# EAGLE design lcd_driver (EAGLE 5.10)
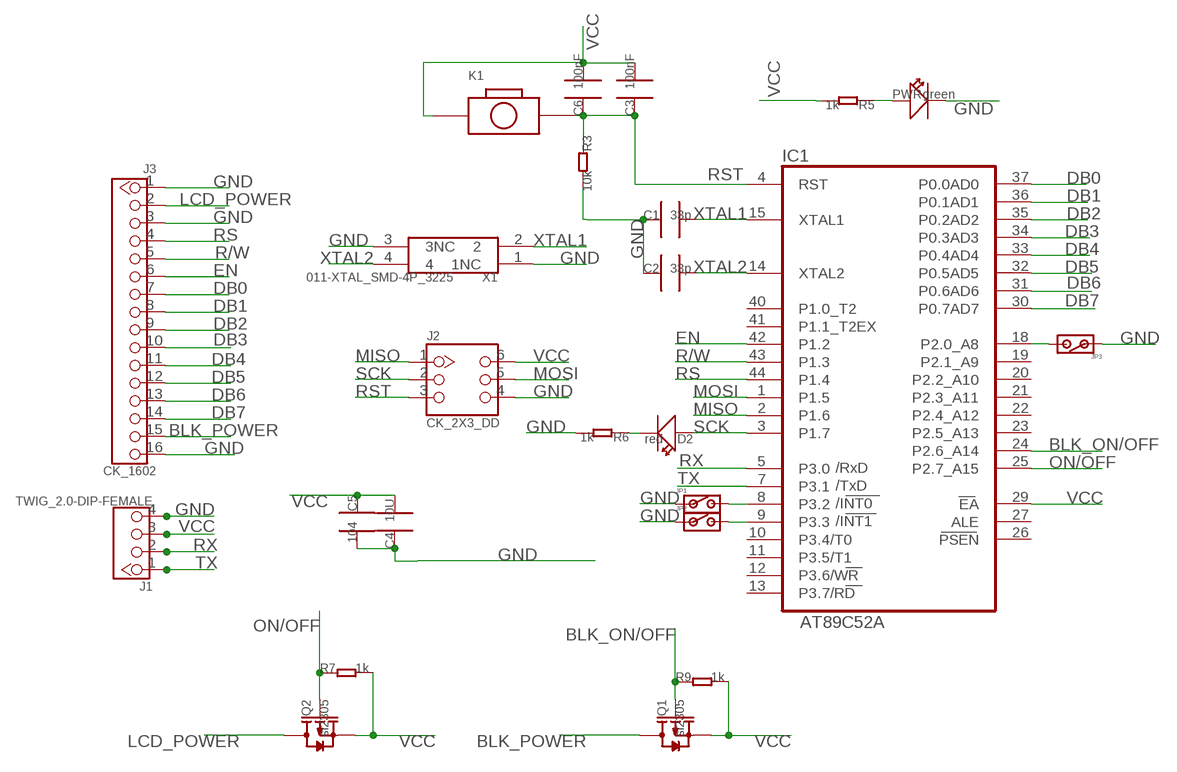
[diagram p0: schematic, sheet 1]

## Parts
C1  33p  006-C0603  [0603]
C2  33p  006-C0603  [0603]
C3  100nF  006-C0603  [0603]
C4  10U  006-C0805  [0805]
C5  104  006-C0603  [0603]
C6  100nF  006-C0603  [0603]
D2  red  LED0603_DD  [LED0603]
IC1  AT89C52A  [TQFP44]
J1  TWIG_2.0-DIP-FEMALE  [2.0_1X4]
J2  CK_2X3_DD  [CK_2X3]
J3  CK_1602  [CK_1602]
JP1  008-JP_SW  [JP_SW]
JP2  008-JP_SW  [JP_SW]
JP3  008-JP_SW  [JP_SW]
K1  BOTTON_1_DP  [BTN_5.0_RST]
PWR  green  LED0603_DD  [LED0603]
Q1  si2305  014-P-MOSFETSOT23  [SOT23_]
Q2  si2305  014-P-MOSFETSOT23  [SOT23_]
R3  10k  005-R0603  [0603]
R5  1k  005-R0603  [0603]
R6  1k  005-R0603  [0603]
R7  1k  005-R0603  [0603]
R9  1k  005-R0603  [0603]
X1  011-XTAL_SMD-4P_3225  [X3225]

## Nets
BLK_ON/OFF: IC1.24(P2.6_A14) Q1.1(G) R9.1
BLK_POWER: J3.15 Q1.3(D)
DB0: IC1.37(P0.0AD0) J3.7
DB1: IC1.36(P0.1AD1) J3.8
DB2: IC1.35(P0.2AD2) J3.9
DB3: IC1.34(P0.3AD3) J3.10
DB4: IC1.33(P0.4AD4) J3.11
DB5: IC1.32(P0.5AD5) J3.12
DB6: IC1.31(P0.6AD6) J3.13
DB7: IC1.30(P0.7AD7) J3.14
EN: IC1.42(P1.2) J3.6
GND: C1.1 C2.1 C4.1 C5.2 J1.4 J2.4 J3.1 J3.3 J3.16 JP1.1 JP2.1 JP3.1 PWR.2(-) R3.2 R6.2 X1.1(1NC) X1.3(3NC)
LCD_POWER: J3.2 Q2.3(D)
MISO: IC1.2(P1.6) J2.1
MOSI: IC1.1(P1.5) J2.5
N$1: IC1.8(P3.2) JP1.2
N$2: IC1.9(P3.3) JP2.2
N$4: PWR.1(+) R5.1
N$6: D2.2(-) R6.1
N$7: IC1.18(P2.0_A8) JP3.2
ON/OFF: IC1.25(P2.7_A15) Q2.1(G) R7.1
R/W: IC1.43(P1.3) J3.5
RS: IC1.44(P1.4) J3.4
RST: C3.1 C6.1 IC1.4(RST) J2.3 K1.P$2 R3.1
RX: IC1.5(P3.0) J1.2
SCK: D2.1(+) IC1.3(P1.7) J2.2
TX: IC1.7(P3.1) J1.1
VCC: C3.2 C4.2 C5.1 C6.2 IC1.29(EA) J1.3 J2.6 K1.P$1 Q1.2(S) Q2.2(S) R5.2 R7.2 R9.2
XTAL1: C1.2 IC1.15(XTAL1) X1.2
XTAL2: C2.2 IC1.14(XTAL2) X1.4
Unconnected: IC1.10(P3.4/T0) IC1.11(P3.5/T1) IC1.12(P3.6/WR) IC1.13(P3.7/RD) IC1.19(P2.1_A9) IC1.20(P2.2_A10) IC1.21(P2.3_A11) IC1.22(P2.4_A12) IC1.23(P2.5_A13) IC1.26(PSEN) IC1.27(ALE) IC1.40(P1.0_T2) IC1.41(P1.1_T2EX)

## Power pins joined to a net without a drawn wire
GND: IC1.16(GND)
VCC: IC1.38(VCC)

## Library data of the parts
C1-C6 = Discrete:006-C*: Ceramic Capacitors
D2 PWR = CPT_SMD:LED0603
IC1 = atmel:AT89C*52: MICROCONTROLLER 8 Kbytes FLASH; 2K Bytes EEPROM Compatible with MCS-51 Products at89s8252.pdf
J1 = Connector:TWIG_2.0-DIP-FEMALE
J2 = CONNECTER:CK_2X3
J3 = CONNECTER:CK_1602
JP1-JP3 = Discrete:008-JP_SW
K1 = CPT_SMD:BOTTON_1
Q1 Q2 = Discrete:014-P-MOSFET*: Si2305DS Si2323CDS
R3 R5-R7 R9 = Discrete:005-R*
X1 = Discrete:011-XTAL_SMD-4P

## Net classes
0 default: width 0.203 mm, drill 0.305 mm, clearance 0.203 mm

## Board
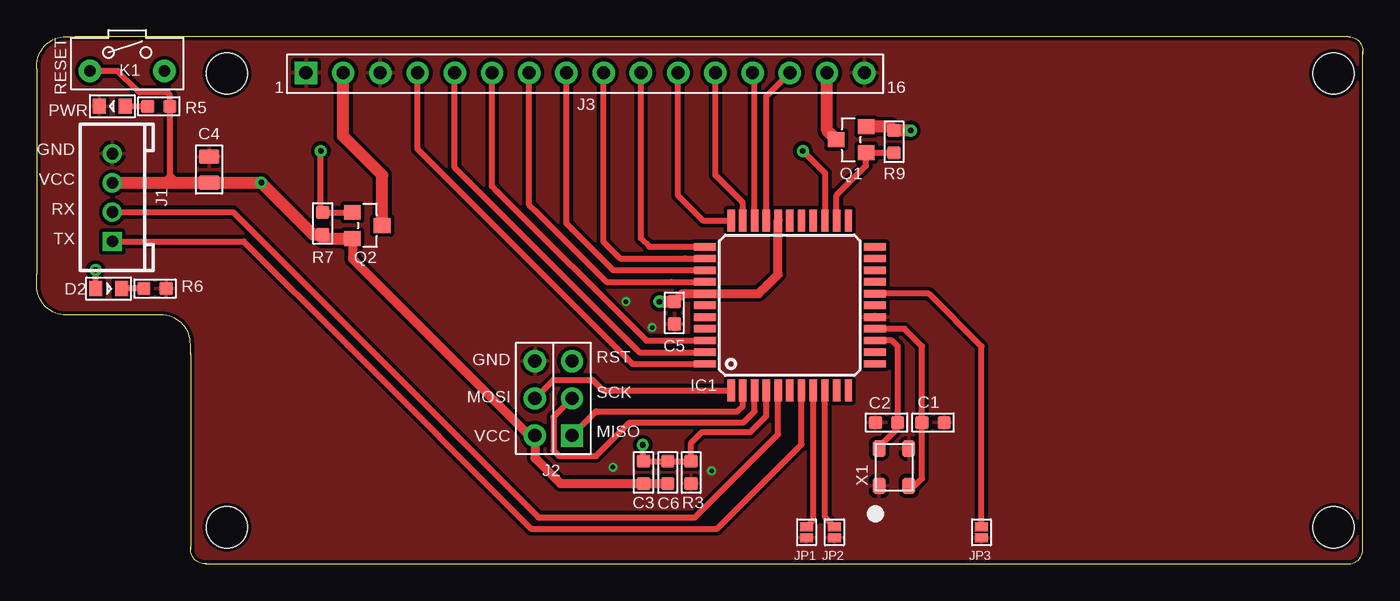
[diagram p1: board, top side]
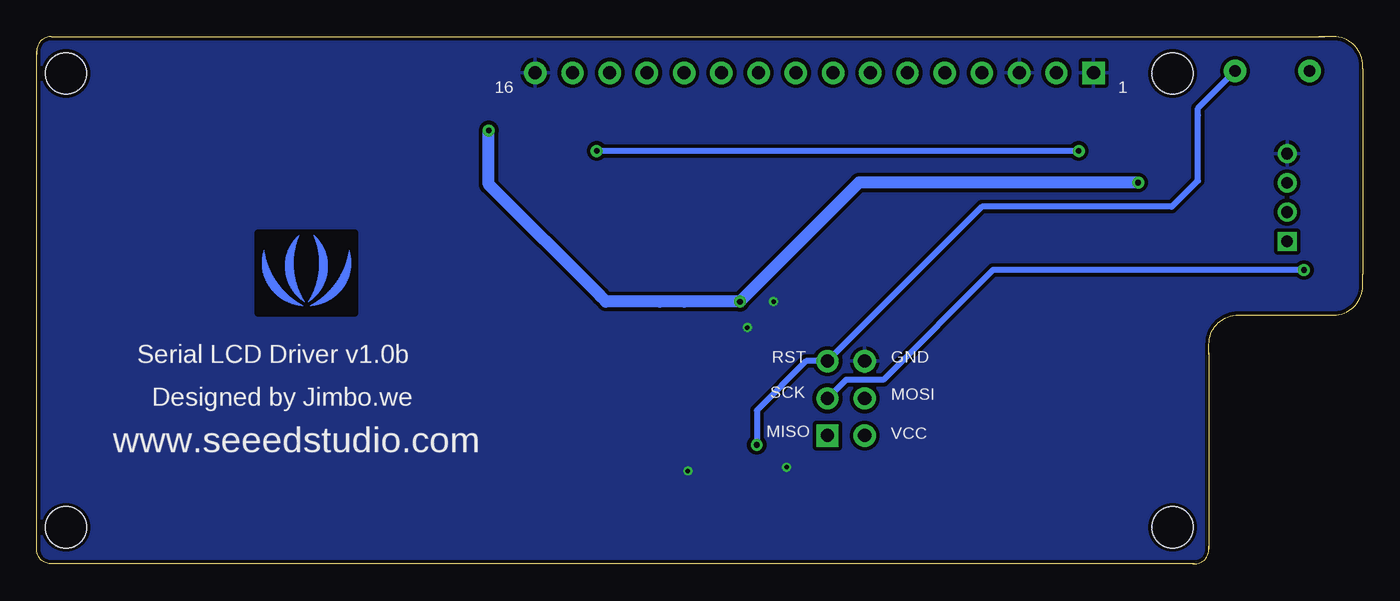
[diagram p2: board, bottom side, seen from below]

Size 90.5 x 36 mm. Coordinates in mm from the lower left corner, seen from the top.
Outline: 10.5,14.35 10.5,14.4
Outline: 10.5,14.4 10.5,14.35
Outline: 10.5,14.35 10.5,14.3
Outline: 10.5,14.3 10.5,1.2
Outline: 10.5,1.2 10.5,1
Outline: 11.5,0 11.6,0
Outline: 11.6,0 89.5,0 arc90 90.5,1
Outline: 90.5,1 90.5,1.1
Outline: 90.5,1.1 90.5,34.8
Outline: 90.5,34.8 90.5,35
Outline: 3,36 10.5,36 89.5,36 arc-90 90.5,35
Outline: 3,36 2.6,36
Outline: 0,19.8 0,33.8 0,33.9 0,34 arc-90 2,36 3,36
Outline: 0,19.8 0,19.76
Outline: 10.5,14.35 10.5,14.4
Outline: 90.5,35 90.5,34.8
Outline: 90.5,1 90.5,1.1
Outline: 11.6,0 11.5,0
Outline: 11.5,0 arc-90 10.5,1
Outline: 10.5,1 10.5,1.2
Outline: 10.5,14.3 10.5,15 arc90 8.5,17 2,17 arc-90 0,19 0,19.8
Copper layers (1*16): Top 0.035mm / dielectric 1.5mm / Bottom 0.035mm
Design rules "SeeedStudio_rule_no_angle_090911": minimum track width 6mil, minimum drill 12mil, track to track 6mil, track to pad 6mil, pad to pad 6mil, via to via 6mil, smd to smd 0mil, copper to edge 10mil, drill to drill 10mil, minimum pad ring 10mil, minimum via ring 6mil, stop-mask expansion 2mil, vias tented up to drill 100mil, thermal gap 10mil
Holes 2.8 mm at 88.5,33.5 88.5,2.5 13,2.5 13,33.5
bKeepout: area 68.8,17.1 to 75.4,22.6
bRestrict: area 68.8,17.1 to 75.4,22.6
vRestrict: area 17.5,28 to 23.3,32; area 17.5,4 to 23.3,8.2; area 46.9,28 to 52.7,32; area 46.9,4 to 52.7,8.2; area 76.7,28 to 82.5,32; area 76.7,4 to 82.5,8.2; area 27.8,8.6 to 42.2,23; area 57.5,10.3 to 68.5,21.3; area 76.5,11.2 to 82.5,16.2; area 13.5,11.7 to 18.2,26.5; area 18.4,8.8 to 23.2,11.4

### Footprints (pad centres in the part's own frame; a part is rotated, then mirrored left to right if it is on the bottom)
0603 = smd 0.889 x 0.889: 1 -0.762,0; 2 0.762,0
0805 = smd 1.016 x 1.397: 1 -0.889,0; 2 0.889,0
LED0603 = smd 0.889 x 1.016: 1 -0.889,0; 2 0.889,0
TQFP44@1 = smd 1.5 x 0.5: 1 -5.8,4; 2 -5.8,3.2; 3 -5.8,2.4; 4 -5.8,1.6; 5 -5.8,0.8; 6 -5.8,0; 7 -5.8,-0.8; 8 -5.8,-1.6; 9 -5.8,-2.4; 10 -5.8,-3.2; 11 -5.8,-4; 23 5.8,-4; 24 5.8,-3.2; 25 5.8,-2.4; 26 5.8,-1.6; 27 5.8,-0.8; 28 5.8,0; 29 5.8,0.8; 30 5.8,1.6; 31 5.8,2.4; 32 5.8,3.2; 33 5.8,4 | smd 0.5 x 1.5: 12 -4,-5.8; 13 -3.2,-5.8; 14 -2.4,-5.8; 15 -1.6,-5.8; 16 -0.8,-5.8; 17 0,-5.8; 18 0.8,-5.8; 19 1.6,-5.8; 20 2.4,-5.8; 21 3.2,-5.8; 22 4,-5.8; 34 4,5.8; 35 3.2,5.8; 36 2.4,5.8; 37 1.6,5.8; 38 0.8,5.8; 39 0,5.8; 40 -0.8,5.8; 41 -1.6,5.8; 42 -2.4,5.8; 43 -3.2,5.8; 44 -4,5.8
2.0_1X4 = drill 0.8 pad 1.27 square: 1 -3,0 | drill 0.8 pad 1.27 round: 2 -1,0; 3 1,0; 4 3,0
CK_2X3 = drill 0.889 pad 1.524 square: 1 -1.27,2.54 | drill 0.889 pad 1.524 round: 2 -1.27,0; 3 -1.27,-2.54; 4 1.27,-2.54; 5 1.27,0; 6 1.27,2.54
CK_1602 = drill 0.889 pad 1.524 square: 1 0,19.05 | drill 0.889 pad 1.524 round: 2 0,16.51; 3 0,13.97; 4 0,11.43; 5 0,8.89; 6 0,6.35; 7 0,3.81; 8 0,1.27; 9 0,-1.27; 10 0,-3.81; 11 0,-6.35; 12 0,-8.89; 13 0,-11.43; 14 0,-13.97; 15 0,-16.51; 16 0,-19.05
JP_SW = smd 0.889 x 0.61: 1 0,0.381; 2 0,-0.381
BTN_5.0_RST = drill 0.762 pad 1.524 round: P$1 0,2.54; P$2 0,-2.54
SOT23_ = smd 1.016 x 1.143: 1 -0.889,-1.016; 2 0.889,-1.016; 3 0,1.016
X3225 = smd 1.143 x 0.889: 1 -1.27,1.016; 2 -1.27,-1.016; 3 1.27,-1.016; 4 1.27,1.016

### Placement (x,y rotation side)
C1  61.17,9.65 180 top
C2  58,9.65 0 top
C3  41.41,6.25 270 top
C4  11.77,26.92 270 top
C5  43.52,17.14 270 top
C6  43.06,6.25 270 top
D2  4.91,18.8 0 top
IC1  AT89C52A  [TQFP44@1]  51.39,17.65 90 top
J1  5.17,25.02 90 top
J2  35.27,11.3 180 top
J3  37.42,33.53 90 top
JP1  52.54,2.16 180 top
JP2  54.44,2.16 180 top
JP3  64.47,2.16 180 top
K1  6.18,33.66 90 top
LOGO2  LOGO_COPPER200X166  [LOGO_COPPER]  72.09,19.3 0 bottom
PWR  5.17,31.24 180 top
Q1  55.59,28.96 90 top
Q2  22.56,23.11 270 top
R3  44.66,6.25 270 top
R5  8.34,31.24 0 top
R6  8.09,18.8 0 top
R7  19.52,23.24 270 top
R9  58.51,28.83 90 top
X1  58.51,6.6 90 top

### Tracks (layer width: path | path; a pad name or v marks a point on that pad's centre or on a via)
BLK_ON/OFF
  Top 0.406: R9.1 Q1.1 56.6,27.18 54.59,25.17 IC1.24
BLK_POWER
  Top 0.813: J3.15 53.93,29.59 Q1.3
DB0
  Top 0.406: IC1.37 43.32,19.25 38.87,19.25 34,24.13 33.61,24.51 J3.7
DB1
  Top 0.406: IC1.36 43.79,20.05 39.34,20.05 36.53,22.86 36.15,23.24 J3.8
DB2
  Top 0.406: IC1.35 44.26,20.85 39.81,20.85 39.08,21.59 38.69,21.97 J3.9
DB3
  Top 0.406: IC1.34 41.81,21.65 41.23,22.23 J3.10
DB4
  Top 0.406: IC1.33 45.47,23.45 43.77,25.15 J3.11
DB5
  Top 0.406: J3.12 46.31,27.69 46.31,26.54 48.09,24.77 48.19,24.66 IC1.32
DB6
  Top 0.406: J3.13 48.99,33.39 IC1.31
DB7
  Top 0.406: IC1.30 49.79,31.93 J3.14
EN
  Top 0.406: IC1.42 41.6,15.25 31.45,25.4 31.07,25.78 J3.6
GND  (via drill 0.3)
  other vias: 39.33,6.6 46.06,6.35 40.22,17.91 42,16.13
  pour Top: 6.05,40.01 7.33,40.01 7.33,38.73 6.05,38.73
  pour Bottom (isolate 0.254): 0.09,-0.38 90.64,-0.25 90.64,36.2 0.09,36.07
  pour Top (isolate 0.254): 0.09,-0.38 0.09,36.07 90.64,36.2 90.64,-0.25
LCD_POWER
  Top 0.813: Q2.3 23.58,26.54 20.91,29.21 J3.2
MISO
  Top 0.406: IC1.2 48.19,10.77 47.84,10.41 38.19,10.41 J2.1
MOSI
  Top 0.406: IC1.1 38.65,11.85 37.93,12.57 35.27,12.57 J2.5
N$1
  Top 0.406: IC1.8 52.99,3 JP1.2
N$2
  Top 0.406: IC1.9 53.79,3.19 JP2.2
N$4
  Top 0.406: PWR.1 R5.1
N$6
  Top 0.406: R6.1 D2.2
N$7
  Top 0.406: IC1.18 60.88,18.45 64.47,14.86 JP3.2
ON/OFF  (via drill 0.38 pad 0.81)
  Top 0.406: Q2.1 R7.1 19.39,24 v19.39,28.19 | IC1.25 53.79,26.68 v52.28,28.19
  Bottom 0.406: v19.39,28.19 v52.28,28.19
R/W
  Top 0.406: IC1.43 41.13,14.45 29.55,26.04 28.53,27.05 J3.5
RS
  Top 0.406: IC1.44 40.66,13.65 28.28,26.04 25.99,28.32 J3.4
RST  (via drill 0.38 pad 0.81)
  Top 0.406: IC1.4 49.79,10.09 48.8,9.1 48.7,9 45.41,9 44.66,8.26 R3.1 C6.1 C3.1 41.36,7.06 v41.36,8.13
  Bottom 0.406: K1.P$2 11.26,31.11 11.26,30.61 11.26,26.16 13.04,24.38 25.99,24.38 J2.3 38,13.84 41.36,10.48 v41.36,8.13
RX
  Top 0.406: J1.2 13.4,24.02 20.53,16.89 34.25,3.17 44.92,3.17 50.59,8.85 IC1.5
SCK  (via drill 0.38 pad 0.81)
  Top 0.406: IC1.3 48.99,10.43 48.22,9.65 40.47,9.65 38.19,7.37 35.65,7.37 35.27,7.75 35.27,10.03 J2.2 | D2.1 v4.02,20.07
  Bottom 0.406: v4.02,20.07 16.72,20.07 25.23,20.07 32.73,12.57 35.27,12.57 J2.2
TX
  Top 0.406: J1.1 14.13,22.02 21.25,14.91 33.74,2.41 46.44,2.41 52.19,8.17 IC1.7
VCC  (via drill 0.38 pad 0.81)
  Top 0.406: K1.P$1 5.54,33.66 6.8,32.4 7,32.2 8.9,32.2 9.1,32 R5.2 9.1,26.54 | 9.1,26.54 9.48,26.16 9.1,26.54 | 9.1,26.54 9.1,26.53 8.6,26.02
  Top 0.61: C5.1 44.07,18.45 IC1.38 49.27,18.45 49.87,19.05 50.59,19.77 IC1.29 | C6.2 C3.2 35.75,5.49 34,7.24 J2.6 33.61,8.76 21.55,20.83 Q2.2
  Top 0.813: C4.2 12.39,26.02 | C4.2 v15.33,26.04 18.88,22.48 19.26,22.48 19.52,22.23 | J1.3 8.6,26.02 11.77,26.02 C4.2 | Q1.2 58.25,29.84 R9.2 v59.65,29.59 | 19.52,22.23 Q2.2 | 19.52,22.23 R7.2 | v42.5,17.91 C5.1 v42.5,17.91
  Bottom 0.406: 26.38,26.04 26.76,26.04
  Bottom 0.813: v15.33,26.04 26.38,26.04 26.76,26.04 34.38,26.04 v42.5,17.91 46.31,17.91 47.97,17.91 51.65,17.91 52.03,18.29 59.65,25.91 v59.65,29.59
XTAL1
  Top 0.406: X1.2 59.9,5.33 60.41,5.84 60.41,9.53 C1.2 60.41,14.86 59.22,16.05 IC1.15
XTAL2
  Top 0.406: IC1.14 58.37,15.25 58.76,14.86 C2.2 58.76,9.27 57.49,8 X1.4

### Text on the board
tPlace: RESET | 1 | 16 | GND | VCC | RX | TX | GND | RST | MOSI | SCK | VCC | MISO
bPlace: 1 | 16 | GND | RST | Serial LCD Driver v1.0b | MOSI | SCK | Designed by Jimbo.we | VCC | MISO | www.seeedstudio.com